# EAGLE schematic street_light (EAGLE 6.5.0)
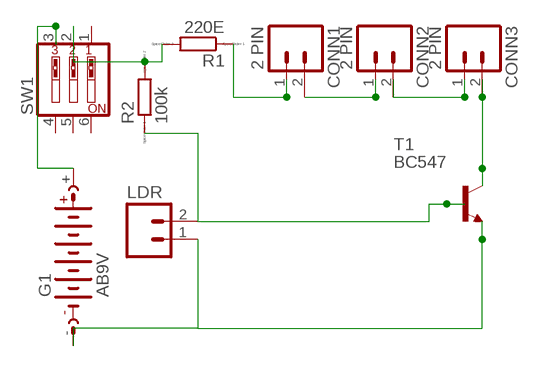
[diagram p0: schematic, sheet 1]

## Parts
CONN1  2 PIN  M02  [02P]
CONN2  2 PIN  M02  [02P]
CONN3  2 PIN  M02  [02P]
G1  AB9V  [AB9V]
LDR  M02  [02P]
R1  220E  R0204/7  [0204/7]
R2  100k  R0204/7  [0204/7]
SW1  SW_DIP-3  [EDG-03]
T1  BC547  [TO92]

## Nets
N$1: CONN1.1 R1.1
N$2: CONN1.2 CONN2.1
N$3: CONN2.2 CONN3.1
N$4: CONN3.2 T1.3(C)
N$5: G1.+ SW1.3
N$6: R1.2 R2.2 SW1.2
N$7: LDR.2 R2.1 T1.2(B)
N$8: G1.- LDR.1 T1.1(E)
Unconnected: SW1.1 SW1.4 SW1.5 SW1.6

## Library data of the parts
CONN1-CONN3 LDR = con-amp-quick:M02: AMP QUICK CONNECTOR; OC_FARNELL: unknown; OC_NEWARK: unknown
G1 = battery:AB9V: 9-V BATTERY CLIP
R1 R2 = eagle-ltspice:R: RESISTOR, European symbol; SPICEMODEL: NONE; SPICEPREFIX: R
SW1 = special:SW_DIP-3: DIP SWITCH
T1 = transistor:BC547: NPN TRANSISTOR